# EAGLE design esp32-mementoV3-2021 (EAGLE 9.6.2)
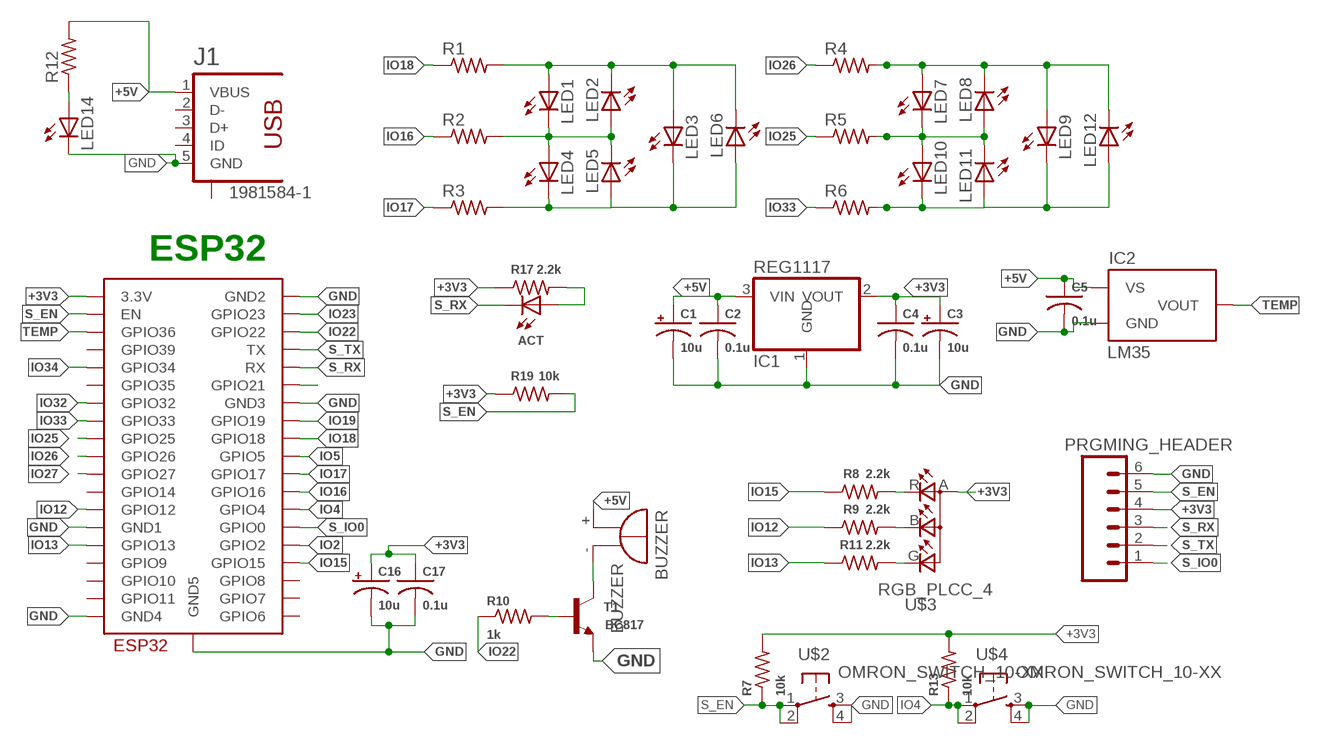
[diagram p0: schematic, sheet 1]

## Parts
ACT  LEDCHIPLED_1206  [CHIPLED_1206]
BUZZER  BUZZER  [F/TMB]
C1  10u  CAP_POL_16V  [B/3528-21R]
C2  0.1u  CAP0603  [C0603]
C3  10u  CAP_POL_16V  [B/3528-21R]
C4  0.1u  CAP0603  [C0603]
C5  0.1u  CAP0603  [C0603]
C16  10u  CAP_POL_16V  [B/3528-21R]
C17  0.1u  CAP0603  [C0603]
ESP32_MODULE  ESP32-WROOM  [ESP32-WROOM]
IC1  REG1117  [SOT223]
IC2  LM35  [TO92]
J1  1981584-1  [1981584-1]
LED1  LED1206  [CHIPLED_1206]
LED2  LED1206  [CHIPLED_1206]
LED3  LED1206  [CHIPLED_1206]
LED4  LED1206  [CHIPLED_1206]
LED5  LED1206  [CHIPLED_1206]
LED6  LED1206  [CHIPLED_1206]
LED7  LED1206  [CHIPLED_1206]
LED8  LED1206  [CHIPLED_1206]
LED9  LED1206  [CHIPLED_1206]
LED10  LED1206  [CHIPLED_1206]
LED11  LED1206  [CHIPLED_1206]
LED12  LED1206  [CHIPLED_1206]
LED14  LED1206  [CHIPLED_1206]
PRGMING_HEADER  M06  [06P]
R1  RESISTOR0805  [R0805]
R2  RESISTOR0805  [R0805]
R3  RESISTOR0805  [R0805]
R4  RESISTOR0805  [R0805]
R5  RESISTOR0805  [R0805]
R6  RESISTOR0805  [R0805]
R7  10k  R-US_M0805  [M0805]
R8  2.2k  R-US_R0805  [R0805]
R9  2.2k  R-US_R0805  [R0805]
R10  1k  R-US_M0805  [M0805]
R11  2.2k  R-US_R0805  [R0805]
R12  RESISTOR0805  [R0805]
R13  10k  R-US_M0805  [M0805]
R17  2.2k  R-US_R0805  [R0805]
R19  10k  R-US_R0805  [R0805]
T1  BC817  BC817-40SMD  [SOT23-BEC]
U$2  OMRON_SWITCH_10-XX  [B3F-10XX]
U$3  RGB_PLCC_4  [PLCC-4]
U$4  OMRON_SWITCH_10-XX  [B3F-10XX]

## Nets
+3V3 [POWER]: C3.+ C4.1 C16.+ C17.1 ESP32_MODULE.3V3(3.3V) IC1.2(VOUT) PRGMING_HEADER.4 R7.2 R13.2 R17.1 R19.1 U$3.A(A2)
+5V: BUZZER.+ C1.+ C2.1 C5.1 IC1.3(VIN) IC2.VS J1.1(VBUS) R12.2
GND [POWER]: C1.- C2.2 C3.- C4.2 C5.2 C16.- C17.2 ESP32_MODULE.GND1 ESP32_MODULE.GND2 ESP32_MODULE.GND3 ESP32_MODULE.GND4 ESP32_MODULE.GND5 IC1.1(GND) IC2.GND J1.5(GND) LED14.C PRGMING_HEADER.6 T1.E U$2.3(S) U$2.4(S1) U$4.3(S) U$4.4(S1)
IO2: ESP32_MODULE.IO2(GPIO2)
IO4: ESP32_MODULE.IO4(GPIO4) R13.1 U$4.1(P) U$4.2(P1)
IO5: ESP32_MODULE.IO5(GPIO5)
IO12: ESP32_MODULE.IO12(GPIO12) R9.1
IO13: ESP32_MODULE.IO13(GPIO13) R11.1
IO15: ESP32_MODULE.IO15(GPIO15) R8.1
IO16: ESP32_MODULE.IO16(GPIO16) R2.1
IO17: ESP32_MODULE.IO17(GPIO17) R3.1
IO18: ESP32_MODULE.IO18(GPIO18) R1.1
IO19: ESP32_MODULE.IO19(GPIO19)
IO22: ESP32_MODULE.IO22(GPIO22) R10.1
IO23: ESP32_MODULE.IO23(GPIO23)
IO25: ESP32_MODULE.IO25(GPIO25) R5.1
IO26: ESP32_MODULE.IO26(GPIO26) R4.1
IO27: ESP32_MODULE.IO27(GPIO27)
IO32: ESP32_MODULE.IO32(GPIO32)
IO33: ESP32_MODULE.IO33(GPIO33) R6.1
IO34: ESP32_MODULE.IO34(GPIO34)
N$1: LED1.A LED2.C LED3.A LED6.C R1.2
N$2: LED1.C LED2.A LED4.A LED5.C R2.2
N$3: LED3.C LED4.C LED5.A LED6.A R3.2
N$4: LED7.A LED8.C LED9.A LED12.C R4.2
N$5: LED7.C LED8.A LED10.A LED11.C R5.2
N$6: LED9.C LED10.C LED11.A LED12.A R6.2
N$12: BUZZER.- T1.C
N$13: ESP32_MODULE.IO21(GPIO21)
N$14: R10.2 T1.B
N$15: ACT.A R17.2
N$16: R8.2 U$3.R(CRED)
N$17: R9.2 U$3.B(CBLUE)
N$18: R11.2 U$3.G(CGREEN)
N$19: LED14.A R12.1
S_EN: ESP32_MODULE.EN PRGMING_HEADER.5 R7.1 R19.2 U$2.1(P) U$2.2(P1)
S_IO0: ESP32_MODULE.IO0(GPIO0) PRGMING_HEADER.1
S_RX: ACT.C ESP32_MODULE.RX PRGMING_HEADER.3
S_TX: ESP32_MODULE.TX PRGMING_HEADER.2
TEMP: ESP32_MODULE.SENSOR_VP(GPIO36) IC2.VOUT
Unconnected: ESP32_MODULE.CLK(GPIO6) ESP32_MODULE.CMD(GPIO11) ESP32_MODULE.IO14(GPIO14) ESP32_MODULE.IO35(GPIO35) ESP32_MODULE.SD0(GPIO7) ESP32_MODULE.SD1(GPIO8) ESP32_MODULE.SD2(GPIO9) ESP32_MODULE.SD3(GPIO10) ESP32_MODULE.SENSOR_VN(GPIO39) J1.2(D-) J1.3(D+) J1.4(ID) J1.S1

## Notes on the sheet
- ESP32

## Library data of the parts
ACT = adafruit:LED: LED OSRAM: - CHIPLED LG R971, LG N971, LY N971, LG Q971, LY Q971, LO R971, LY R971 LH N974, LH R974 LS Q976, LO Q976, LY Q976 LO Q996 - Hyper CHIPLED LW Q18S LB Q993, LB Q99A, LB R99A - SideLED LS A670, LO A670, LY A670, LG A670, LP A670 LB A673, LV A673, LT A673, LW A673 LH A674 LY A675 LS A676, LA A676, LO A676, LY A676, LW A676 LS A679, LY A679, LG A679 - Hyper Micro SIDELED® LS Y876, LA Y876, LO Y876, LY Y876 LT Y87S - SmartLED LW L88C, LW L88S LB L89C, LB L89S, LG L890 LS L89K, LO L89K, LY L89K LS L896, LA L896, LO L896, LY L896 - TOPLED LS T670, LO T670, LY T670, LG T670, LP T670 LSG T670, LSP T670, LSY T670, LOP T670, LYG T670 LG T671, LOG T671, LSG T671 LB T673, LV T673, LT T673, LW T673 LH T674 LS T676, LA T676, LO T676, LY T676, LB T676, LH T676, LSB T676, LW T676 LB T67C, LV T67C, LT T67C, LS T67K, LO T67K, LY T67K, LW E67C LS E67B, LA E67B, LO E67B, LY E67B, LB E67C, LV E67C, LT E67C LW T67C LS T679, LY T679, LG T679 LS T770, LO T770, LY T770, LG T770, LP T770 LB T773, LV T773, LT T773, LW T773 LH T774 LS E675, LA E675, LY E675, LS T675 LS T776, LA T776, LO T776, LY T776, LB T776 LHGB T686 LT T68C, LB T68C - Hyper Mini TOPLED® LB M676 - Mini TOPLED Santana® LG M470 LS M47K, LO M47K, LY M47K Source: http://www.osram.convergy.de/
BUZZER = CEDT_JANUARY_2015_v5:BUZZER: BUZZER Source: Buerklin; OC_FARNELL: unknown; OC_NEWARK: unknown
C1 C3 C16 = CEDT_JANUARY_2015_v5:CAP_POL
C2 C4 C5 C17 = CEDT_JANUARY_2015_v5:CAP
ESP32_MODULE = ESP32:ESP32-WROOM
IC1 = CEDT_JANUARY_2015_v5:REG1117: 800mA and 1A Low Dropout (LDO) Positive Regulator 1.8V, 2.5V, 2.85V, 3.3V, 5V, and Adj
IC2 = CEDT_JANUARY_2015_v5:LM35
J1 = audio amplifier example:1981584-1: Receptacle, micro-USB, type A/B Tyco Electronics
LED1-LED12 LED14 = CEDT_JANUARY_2015_v5:LED
PRGMING_HEADER = con-amp-quick:M06: AMP QUICK CONNECTOR; OC_FARNELL: unknown; OC_NEWARK: unknown
R1-R6 R12 = CEDT_JANUARY_2015_v5:RESISTOR
R7 R10 R13 = rcl:R-US_: RESISTOR, American symbol; SPICEPREFIX: R
R8 R9 R11 R17 R19 = rcl:R-US_: RESISTOR, American symbol
T1 = transistor-npn:BC817*: NPN Transistor
U$2 U$4 = CEDT_JANUARY_2015_v5:OMRON_SWITCH
U$3 = CEDT_JANUARY_2015_v5:RGB_PLCC_4

## Net classes
0 default: width 0.406 mm, drill 0.7 mm, clearance 0.25 mm
1 POWER: width 0.61 mm, drill 0.7 mm, clearance 0.25 mm

## Board
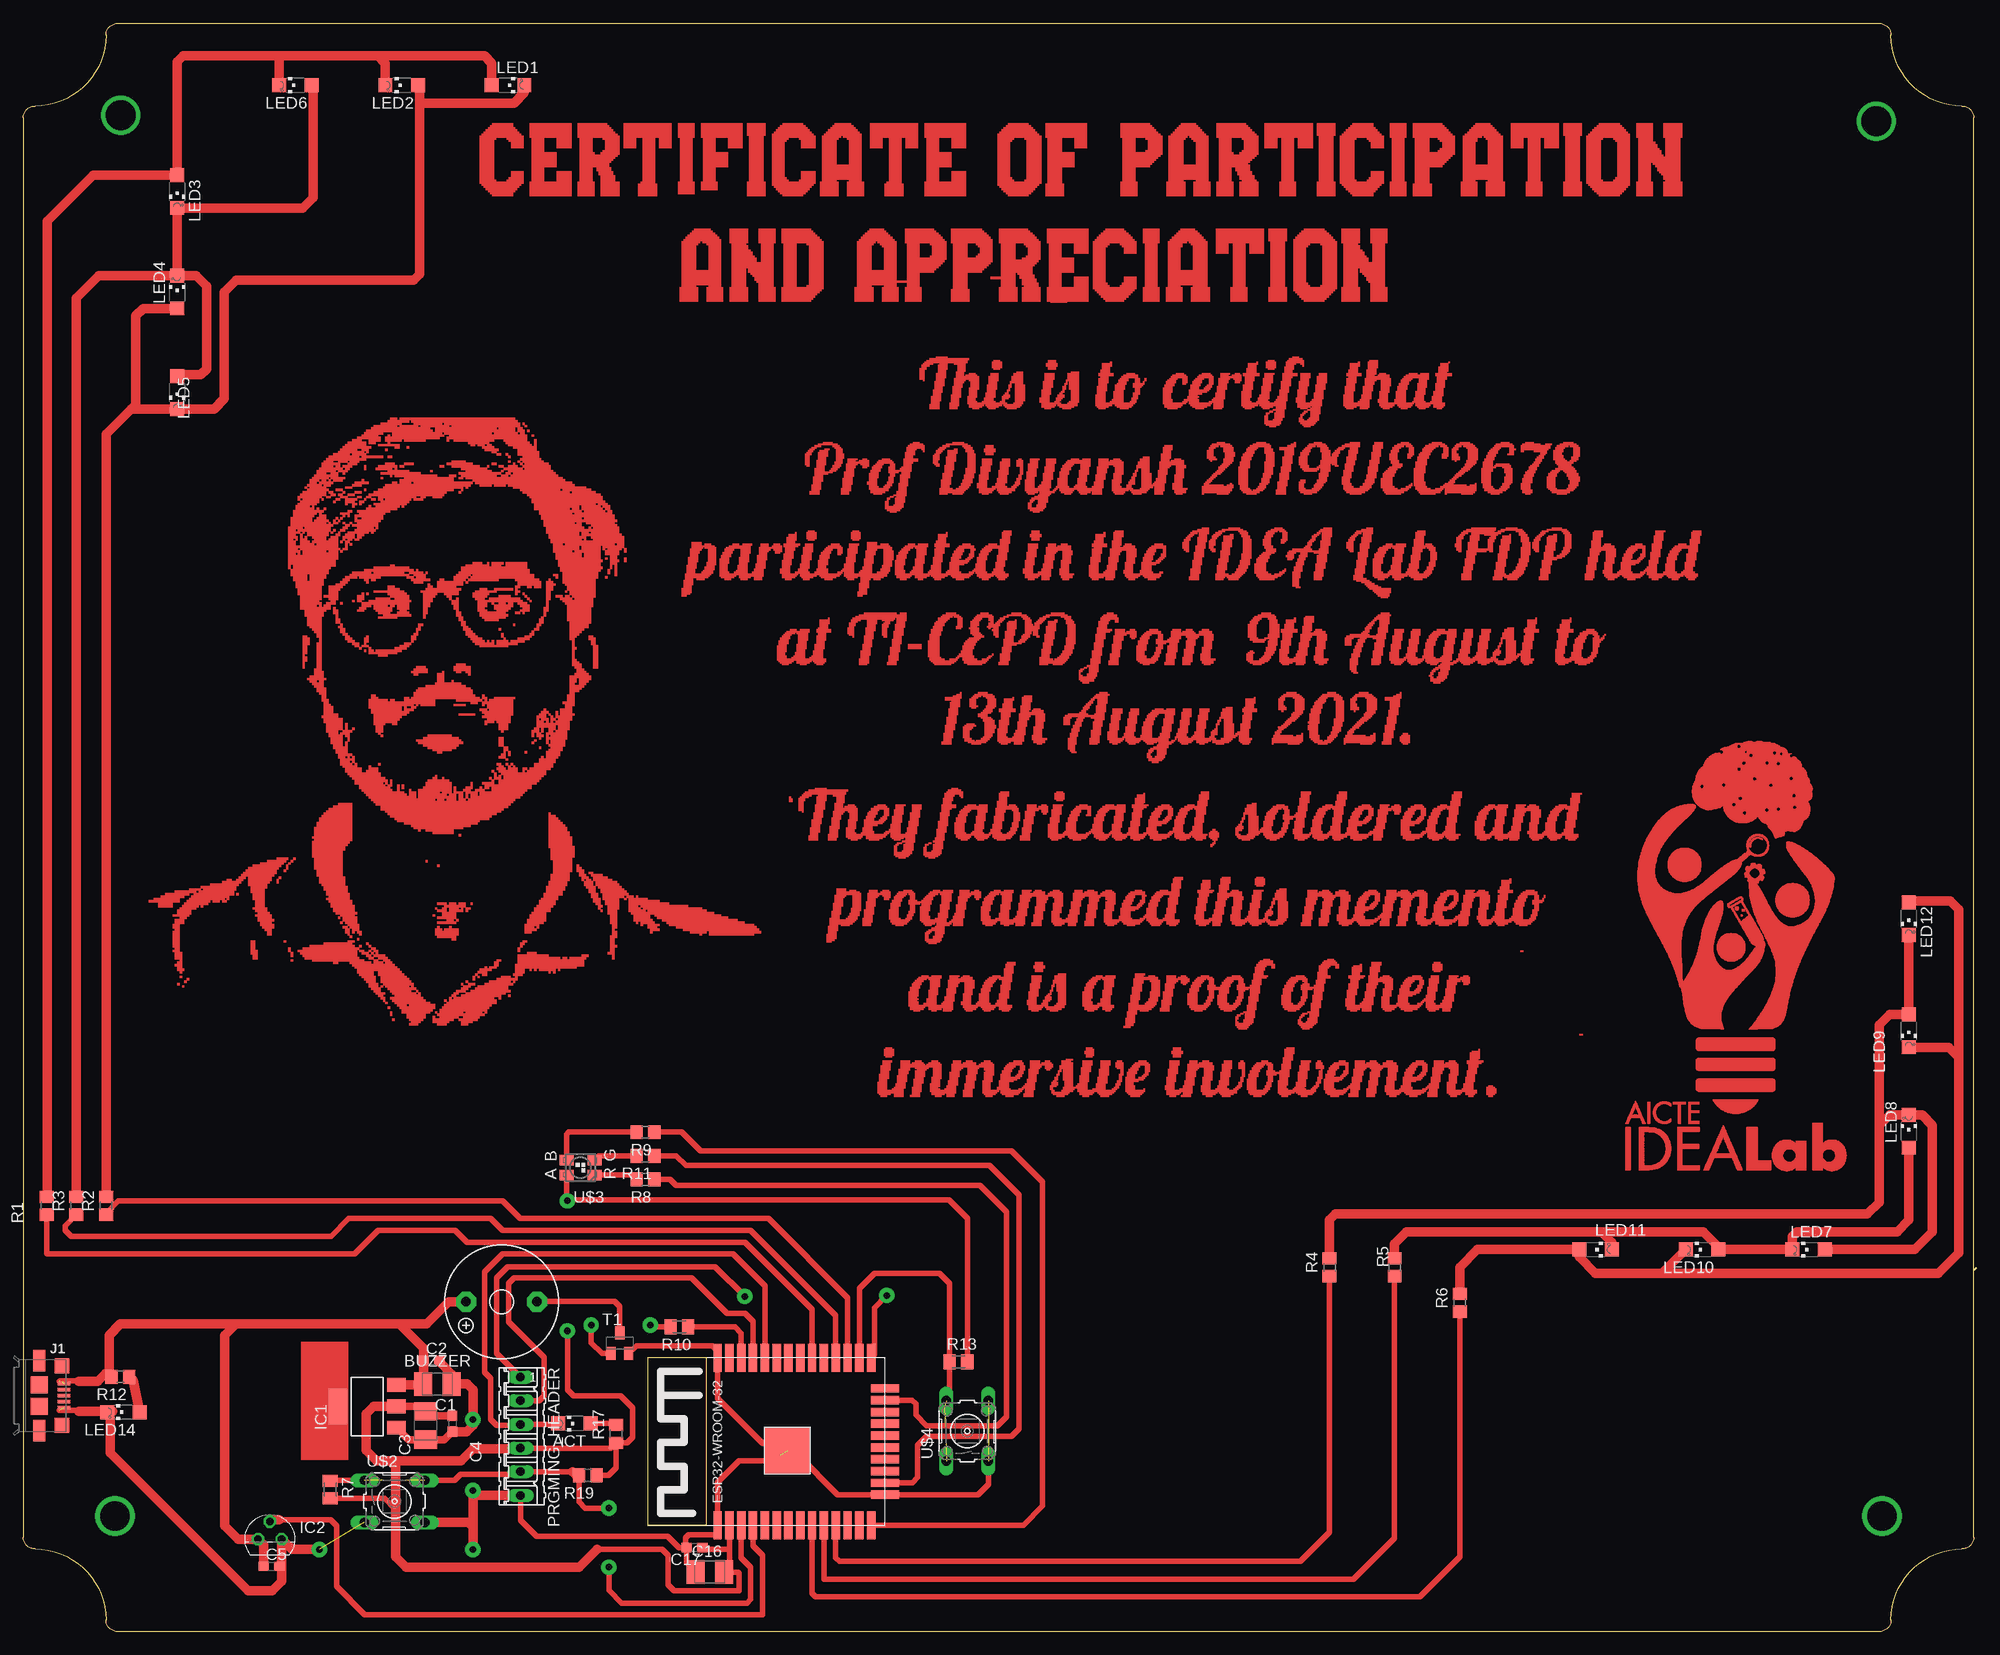
[diagram p1: board, top side]
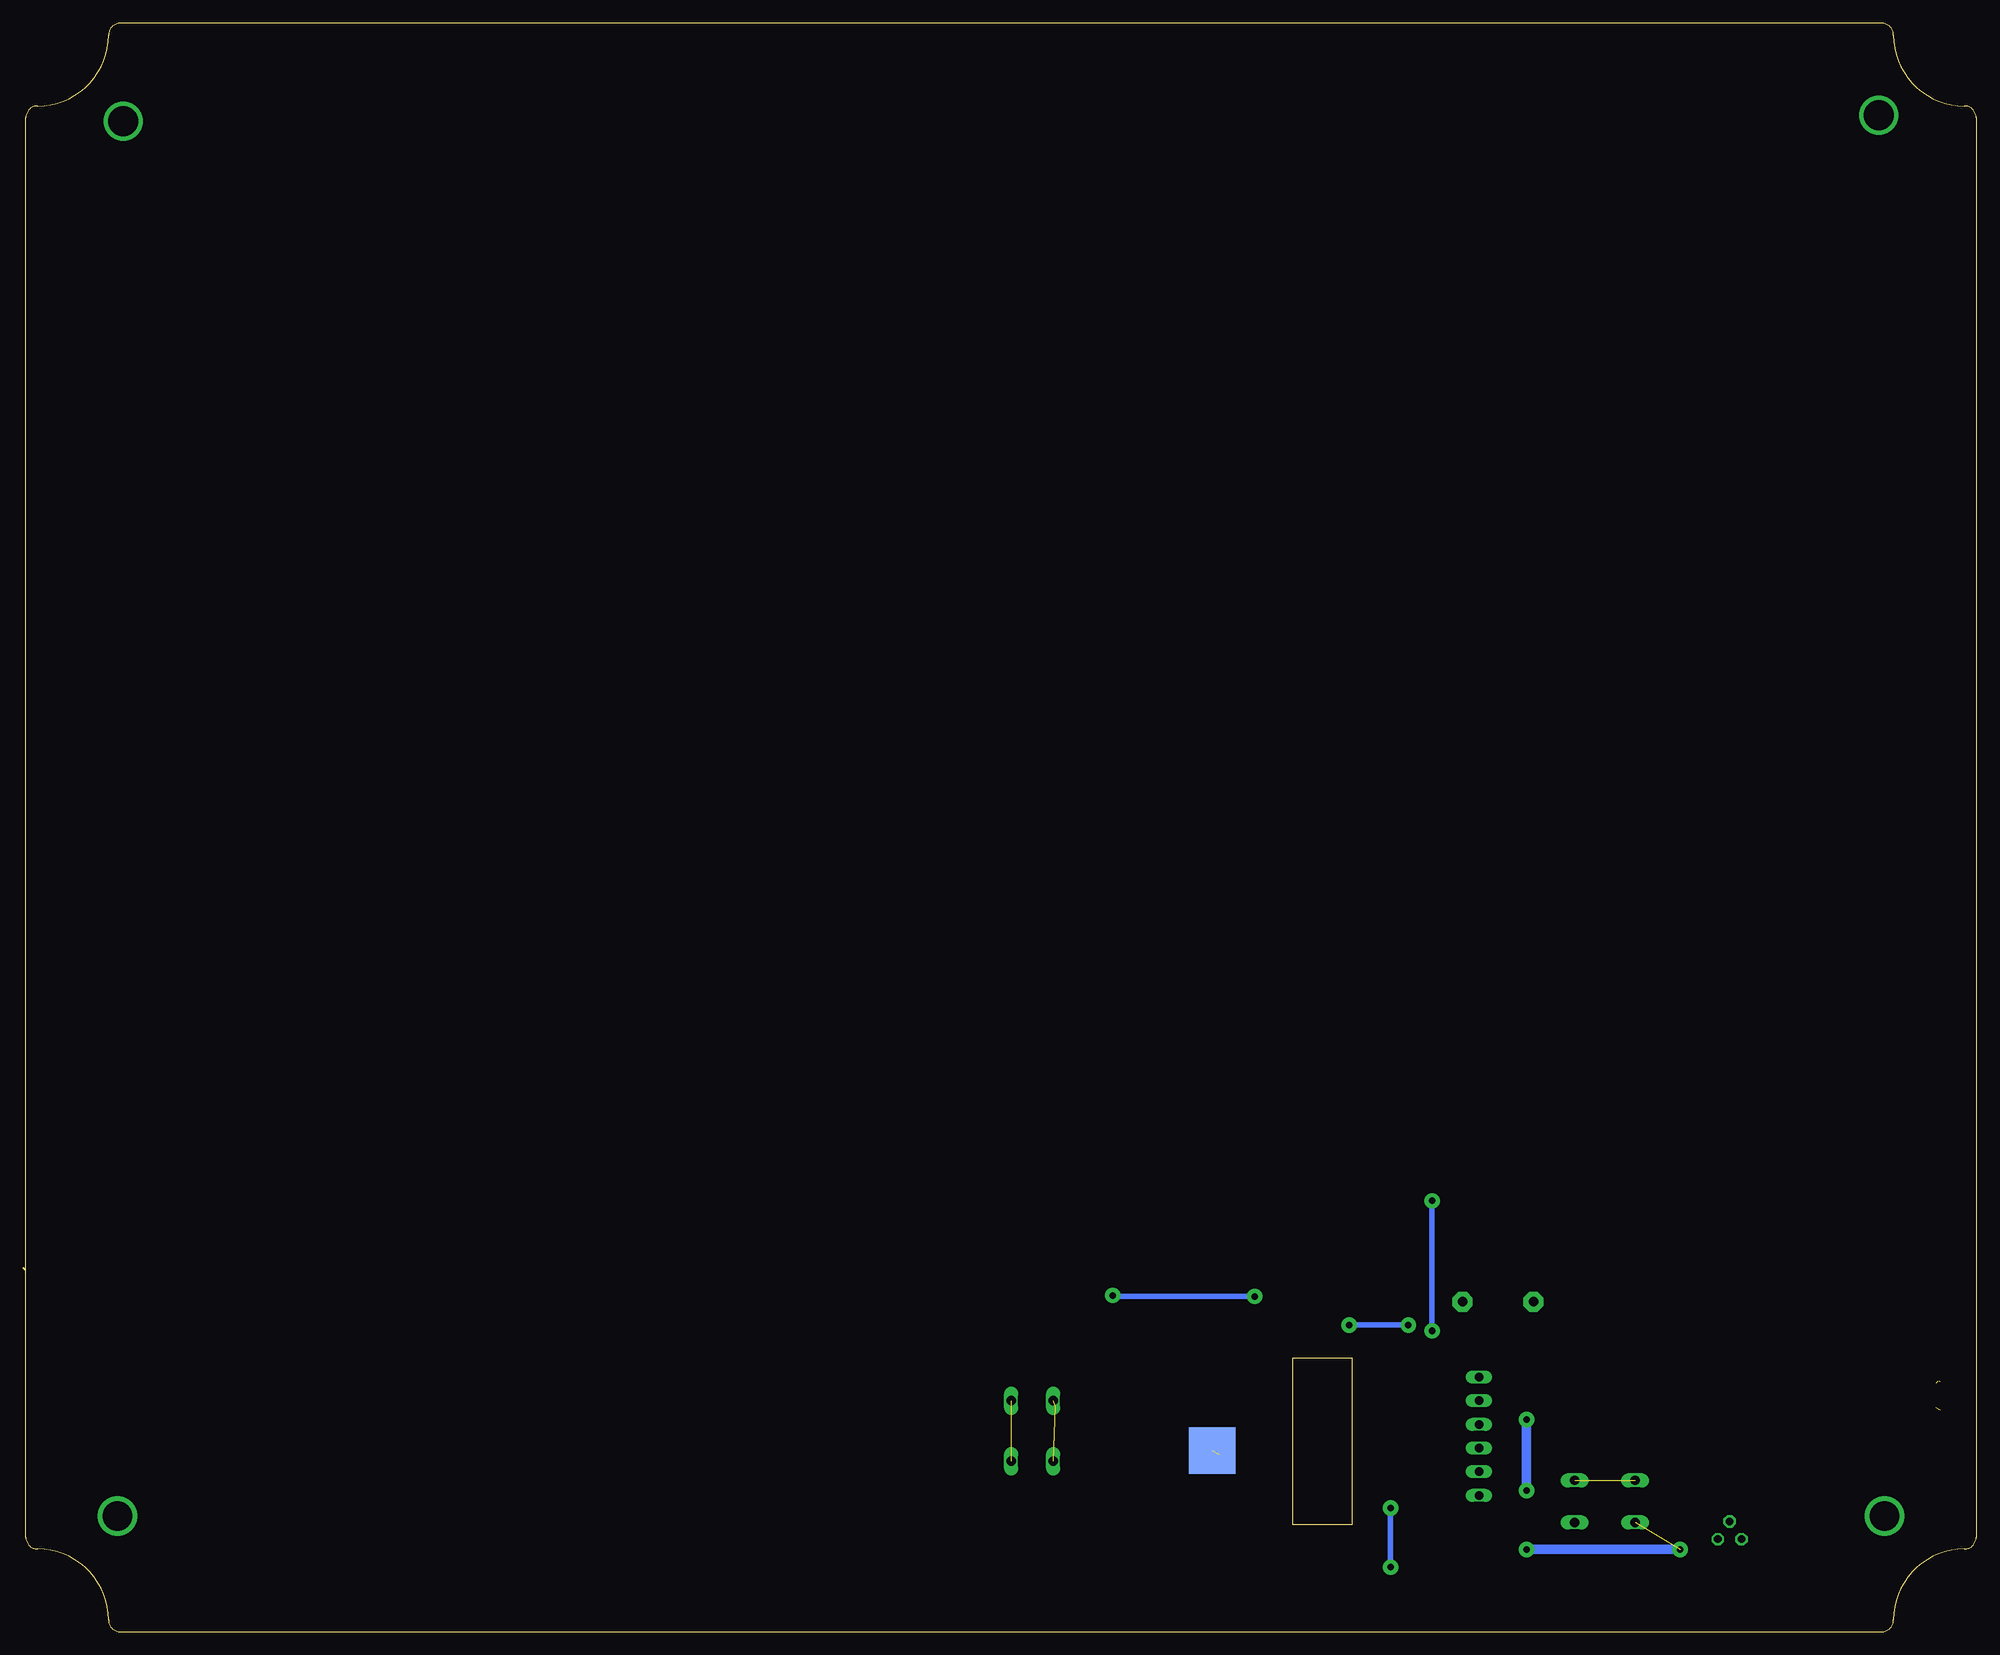
[diagram p2: board, bottom side, seen from below]

Size 209.82 x 172.81 mm. Coordinates in mm from the lower left corner, seen from the top.
Outline: 10.16,0 199.39,0 arc90 200.66,1.27
Outline: 200.66,1.27 arc-90 208.28,8.89 arc90 209.55,10.16 209.55,162.66 arc90 208.28,163.93 arc-90 200.66,171.55 arc90 199.39,172.82 10.16,172.82 arc90 8.89,171.55 arc-90 1.27,163.93 arc90 0,162.66 0,10.16 arc90 1.27,8.89 arc-90 8.89,1.27
Outline: 10.16,0 arc-90 8.89,1.27
Outline: 10.16,0 arc-90 8.89,1.27
Outline: 209.63,38.9 209.82,39.09
Outline: 73.4,29.45 67.07,29.45 67.07,11.47 73.4,11.47 73.4,29.45
Copper layers (1*16): Top 0.035mm / dielectric 1.5mm / Bottom 0.035mm
Design rules "default *": minimum track width 6mil, minimum drill 0.35mm, track to track 16mil, track to pad 16mil, pad to pad 16mil, via to via 16mil, smd to smd 16mil, copper to edge 40mil, drill to drill 6mil, minimum pad ring 10mil, minimum via ring 8mil, stop-mask expansion 4mil, vias tented up to drill 0mil, thermal gap 10mil

### Footprints (pad centres in the part's own frame; a part is rotated, then mirrored left to right if it is on the bottom)
CHIPLED_1206 = smd 1.5 x 1.5: A 0,-1.75; C 0,1.75
F/TMB = drill 1.016 pad 2.159 octagon: + 3.81,0; - -3.81,0
B/3528-21R = smd 1.95 x 2.5: + 1.525,0; - -1.525,0
C0603 = smd 1.1 x 1: 1 -0.85,0; 2 0.85,0
ESP32-WROOM = smd 3 x 0.9: 3V3 0,16.74; EN 0,15.47; GND1 0,18.01; GND3 18,18.01; IO0 18,1.5; IO4 18,2.77; IO5 18,6.58; IO12 0,1.5; IO14 0,2.77; IO16 18,4.04; IO17 18,5.31; IO18 18,7.85; IO19 18,9.12; IO21 18,11.66; IO22 18,15.47; IO23 18,16.74; IO25 0,6.58; IO26 0,5.31; IO27 0,4.04; IO32 0,9.12; IO33 0,7.85; IO34 0,11.66; IO35 0,10.39; NC 18,10.39; RX 18,12.93; SENSOR_VN 0,12.93; SENSOR_VP 0,14.2; TX 18,14.2 | smd 0.9 x 3: CLK 9.635,0; CMD 8.365,0; GND2 3.285,0; IO2 14.715,0; IO13 4.555,0; IO15 13.445,0; SD0 10.905,0; SD1 12.175,0; SD2 5.825,0; SD3 7.095,0 | smd 5 x 5: GND4 8,10.5 | smd 5 x 5 bottom: GND5 8,10.5
SOT223 = smd 1.499 x 2.007: 1 -2.261,-3.15; 2 0.025,-3.15; 3 2.311,-3.15 | smd 3.81 x 2.007: 4 0,3.15
TO92 = drill 0.813 octagon: GND 1.27,0; VOUT 0,1.905; VS -1.27,0
1981584-1 = smd 0.4 x 1.35: 1 -1.3,4.1; 2 -0.65,4.1; 3 0,4.1; 4 0.65,4.1; 5 1.3,4.1 | smd 1.8 x 1.8: M1 -1.15,1.45; M2 1.15,1.45 | smd 2.3 x 1.3: S1 -3.75,1.45; S2 3.75,1.45 | smd 1.6 x 1.6: S3 -3.2,3.885; S4 3.2,3.885
06P = drill 0.914 long: 1 -6.35,0; 2 -3.81,0; 3 -1.27,0; 4 1.27,0; 5 3.81,0; 6 6.35,0
R0805 = smd 1.3 x 1.5: 1 -0.95,0; 2 0.95,0
M0805 = smd 1.3 x 1.6: 1 -0.95,0; 2 0.95,0
SOT23-BEC = smd 1 x 1.4: B -0.95,-1.1; C 0,1.1; E 0.95,-1.1
B3F-10XX = drill 1.016 long: 1 -3.251,2.261; 2 3.251,2.261; 3 -3.251,-2.261; 4 3.251,-2.261
PLCC-4 = smd 1.1 x 1.5: A -0.8,1.5; B 0.8,1.5; G 0.8,-1.5; R -0.8,-1.5

### Placement (x,y rotation side)
ACT  59.2,22.37 90 top
BUZZER  51.38,35.45 180 top
C1  44.5,26.61 180 top
C2  43.87,29.15 0 top
C3  43.23,22.17 90 top
C4  46.09,22.34 270 top
C5  26.67,7.03 0 top
C16  73.76,6.41 0 top
C17  72.1,9.03 180 top
ESP32_MODULE  92.6,11.44 90 top
IC1  36.94,24.2 90 top
IC2  26.49,9.94 0 top
J1  0.27,25.37 270 top
LED1  52.09,166.15 270 top
LED2  40.66,166.15 90 top
LED3  16.53,154.72 180 top
LED4  16.53,143.93 0 top
LED5  16.53,133.13 180 top
LED6  29.23,166.15 90 top
LED7  191.79,41.06 90 top
LED8  202.58,53.76 0 top
LED9  202.58,64.55 180 top
LED10  180.36,41.06 90 top
LED11  168.93,41.06 270 top
LED12  202.58,76.62 180 top
LED14  10.75,23.59 90 top
PRGMING_HEADER  53.43,21 270 top
R1  2.54,45.77 90 top
R2  8.89,45.77 90 top
R3  5.71,45.77 90 top
R4  140.35,39.15 90 top
R5  147.34,39.15 90 top
R6  154.32,35.34 90 top
R7  32.97,15.28 270 top
R8  66.85,48.59 180 top
R9  66.85,53.67 180 top
R10  70.48,32.75 180 top
R11  66.85,51.13 180 top
R12  10.43,27.4 180 top
R13  100.47,28.99 0 top
R17  63.7,21.26 90 top
R19  60.65,16.8 180 top
T1  64.08,31 0 top
U$2  39.89,14.01 0 top
U$3  59.86,49.86 90 top
U$4  101.43,21.56 90 top

### Tracks (layer width: path | path; a pad name or v marks a point on that pad's centre or on a via)
+3V3  (via drill 0.7 pad 1.65)
  Top 0.61: 37.67,24.22 40.69,24.22 | 61.65,8.83 68.63,8.83 69.27,8.2 69.27,5.02 69.9,4.39 76.89,4.39 76.89,6.29 76.77,6.41 C16.+ 75.86,6.98 75.86,8.83 | R17.1 63.7,17.63 62.87,16.8 R19.1 | C17.1 73.15,8.83 75.86,8.83 | U$3.A 58.36,46.4 | v58.47,32.33 58.47,25.98 59.11,25.34 64.19,25.34 65.46,24.07 65.46,20.9 64.87,20.31 R17.1 | ESP32_MODULE.3V3 75.86,8.83 | R13.2 101.42,44.43 99.44,46.4 58.36,46.4 | v58.47,46.3 58.36,46.4 | R7.2 38.81,14.33 40.02,13.12 | R17.1 63.12,19.73 PRGMING_HEADER.4
  Top 0.813: IC1.2 40.69,24.22 42.7,24.22 C3.+ 43.73,23.19 C4.1
  Top 1.016: PRGMING_HEADER.4 53.32,19.63 48.31,19.63 47.04,18.36 39.39,18.36 | IC1.2 37.67,24.22 36.85,23.4 36.85,19.47 37.96,18.36 39.39,18.36 | 61.65,8.83 59.74,6.93 41.13,6.93 40.02,8.04 40.02,13.12 40.02,17.72 39.39,18.36
  Bottom 0.61: v58.47,46.3 v58.47,32.33
+5V  (2 unrouted)
  Top 0.61: 5.98,26.9 5.95,26.9 5.91,26.93 3.99,26.93 | 4.15,26.9 3.89,26.9
  Top 1.016: IC1.3 42.12,26.51 42.54,26.08 42.54,26.18 C1.+ 43.02,26.65 C2.1 43.02,30.42 40.37,33.07 | 40.37,33.07 22.86,33.07 | C5.1 25.82,9.34 IC2.VS 23.07,9.94 21.64,11.37 21.64,31.85 22.86,33.07 | 40.37,33.07 43.34,33.07 45.72,35.45 BUZZER.+ | 5.98,26.9 7.98,26.9 8.85,27.77 9.22,27.4 | R12.2 9.22,27.4 | 9.22,27.4 9.22,31.85 10.44,33.07 22.86,33.07
GND  (via drill 0.7 pad 1.65)  (5 unrouted)
  Top 0.61: PRGMING_HEADER.6 53.43,11.97 55.14,10.26 69.23,10.26 70.46,9.03 C17.2 | T1.E 65.87,30.74 74.03,30.74 74.59,30.18 ESP32_MODULE.GND3 74.59,25.1 79.43,20.26 82.6,20.26 82.6,19.94 ESP32_MODULE.GND5 82.6,18.94 82.6,18.36 76.89,18.36 74.59,16.06 ESP32_MODULE.GND1 74.59,10.42 | 74.59,10.42 74.59,10.34 | C17.2 71.25,7.39 C16.- | C17.2 71.17,9.11 71.17,10.1 71.49,10.42 74.59,10.42 | 81.33,18.99 83.24,18.99 87.5,14.73 ESP32_MODULE.GND2 102.59,14.73 103.69,15.82 U$4.3 | 5.98,23.66 5.98,23.81 3.89,23.81
  Top 0.813: IC1.1 41.38,20.64 C3.- 45.24,20.64 C4.2
  Top 1.016: C2.2 44.72,28.99 46.03,27.68 C1.- 47.68,26.61 48.31,25.98 v48.31,22.8 48.31,22.17 47.64,21.49 C4.2 | IC1.1 40.34,21.94 | 27.76,7.28 IC2.GND 28.87,8.83 v31.8,8.83 | 27.76,7.28 C5.2 | 27.76,7.28 27.76,5.43 26.72,4.39 24.18,4.39 9.35,19.22 9.35,22.96 8.65,23.66 | PRGMING_HEADER.6 48.84,14.65 v48.31,15.18 48.31,11.21 | v48.31,8.83 48.31,11.21 | 5.98,23.66 8.65,23.66 | 8.65,23.66 9.63,23.66 LED14.C | U$2.4 47.78,11.75 48.31,11.21
  Bottom 1.016: v48.31,22.8 v48.31,15.18 | v48.31,8.83 v31.8,8.83
IO4  (2 unrouted)
  Top 0.61: 98.95,24.23 99.52,24.8 R13.1 99.52,37.44 98.44,38.52 91.46,38.52 89.83,36.89 ESP32_MODULE.IO4
IO12
  Top 0.61: ESP32_MODULE.IO12 107.44,11.44 109.53,13.53 109.53,48.33 106.2,51.66 72.76,51.66 70.75,53.67 R9.1
IO13
  Top 0.61: ESP32_MODULE.IO13 95.52,16 96.09,16.57 96.09,20.04 97.04,20.99 106.19,20.99 106.99,21.79 106.99,46.94 103.83,50.09 71.19,50.09 70.14,51.13 R11.1
IO15
  Top 0.61: ESP32_MODULE.IO15 95.48,24.89 95.9,24.47 95.9,23.28 97.04,22.13 104.66,22.13 105.62,23.09 105.62,45.12 102.77,47.96 70.14,47.96 69.51,48.59 R8.1
IO16
  Top 0.61: ESP32_MODULE.IO16 88.56,35.89 80.06,44.39 53.39,44.39 51.49,46.3 10.21,46.3 8.89,44.97 R2.1
IO17
  Top 0.61: ESP32_MODULE.IO17 87.29,33.99 78.16,43.12 51.49,43.12 50.22,44.39 34.98,44.39 33.07,42.49 5.13,42.49 4.5,43.12 4.5,43.6 R3.1
IO18
  Top 0.61: ESP32_MODULE.IO18 84.75,34.62 77.52,41.85 47.68,41.85 46.41,43.12 38.15,43.12 35.61,40.58 2.59,40.58 2.54,40.63 R1.1
IO22
  Top 0.61: R10.1 76.46,32.75 77.13,32.08 ESP32_MODULE.IO22
IO25
  Top 0.61: ESP32_MODULE.IO25 86.02,5.66 142.93,5.66 147.34,10.06 R5.1
IO26
  Top 0.61: R4.1 140.35,10.7 137.21,7.56 87.68,7.56 87.29,7.95 ESP32_MODULE.IO26
IO33
  Top 0.61: ESP32_MODULE.IO33 84.75,4.14 85.14,3.75 150.03,3.75 154.32,8.04 R6.1
N$1
  Top 1.016: R1.2 2.59,46.77 2.59,151.55 7.52,156.47 LED3.A 16.53,168.69 17.16,169.33 27.48,169.33 | LED6.C 27.48,169.33 | 38.12,169.33 38.91,168.54 LED2.C | 27.48,169.33 38.12,169.33 | 38.12,169.33 49.55,169.33 50.34,168.54 LED1.A
N$2
  Top 1.016: 8.72,46.88 R2.2 8.89,128.67 11.6,131.38 | 16.37,142.02 LED4.A 12.87,142.18 12.08,141.39 12.08,131.86 11.6,131.38 | 11.6,131.38 LED5.C 20.49,131.38 21.61,132.5 21.61,143.93 22.88,145.2 41.93,145.2 42.56,145.83 42.56,164.25 | 42.56,164.25 42.56,166 LED2.A | 42.56,164.25 52.72,164.25 53.84,165.36 LED1.C
N$3
  Top 1.016: LED4.C LED3.C 30.02,152.97 31.13,154.09 31.13,166 LED6.A | LED4.C 16.68,145.83 | R3.2 5.71,143.28 8.12,145.68 LED4.C | LED5.A 16.68,135.04 19.07,135.04 19.7,135.67 19.7,144.56 18.59,145.68 LED4.C
N$4
  Top 1.016: R4.2 140.35,44.23 140.99,44.87 198.14,44.87 199.41,46.14 199.41,54.39 | 199.41,54.39 200.52,55.51 LED8.C 204.01,55.51 205.12,54.39 205.12,42.96 203.22,41.06 LED7.A | 199.41,54.39 199.41,65.19 200.52,66.3 LED9.A LED12.C
N$5
  Top 1.016: 189.88,41.21 LED7.C | R5.2 147.34,41.69 148.61,42.96 169.56,42.96 | 169.56,42.96 170.68,41.85 LED11.C | 169.56,42.96 180.51,42.96 182.26,41.21 LED10.A LED7.C | LED7.C 190.04,42.48 190.52,42.96 201.31,42.96 202.58,44.23 LED8.A
N$6
  Top 1.016: 202.74,62.65 LED9.C 206.87,62.8 207.96,61.71 | R6.2 154.32,39.15 156.23,41.06 LED11.A 167.18,40.27 168.93,38.52 176.07,38.52 | LED10.C 176.07,38.52 | 176.07,38.52 205.76,38.52 207.96,40.72 207.96,61.71 | 207.96,61.71 207.96,77.59 207.03,78.52 202.74,78.52 LED12.A
N$7  (via drill 3.2 pad 3.81)
  other vias: 199.07,162.29
N$8  (via drill 3.2 pad 3.81)
  other vias: 199.71,12.43
N$9  (via drill 3.2 pad 3.81)
  other vias: 10.48,162.92
N$10  (via drill 3.2 pad 3.81)
  other vias: 9.84,12.43
N$12
  Top 0.61: BUZZER.- 55.24,35.5 63.55,35.5 64.08,34.97 T1.C
N$14  (via drill 0.7 pad 1.65)
  Top 0.61: R10.2 67.57,32.75 v67.36,32.96 | v61.01,32.96 61.01,31.06 62.17,29.9 T1.B
  Bottom 0.61: v67.36,32.96 v61.01,32.96
N$15
  Top 0.61: ACT.A 63.54,22.37 R17.2
N$16
  Top 0.61: U$3.R 65.43,49.06 R8.2
N$17
  Top 0.61: U$3.B 58.36,53.44 58.59,53.67 R9.2
N$18
  Top 0.61: U$3.G 61.83,51.13 R11.2
N$19
  Top 1.016: R12.1 11.8,26.99 LED14.A
S_EN  (via drill 0.7 pad 1.65)  (1 unrouted)
  Top 0.61: 59,17.19 53.99,17.19 | 53.99,17.19 PRGMING_HEADER.5 | v62.92,6.93 62.92,4.44 64.29,3.06 77.75,3.06 78.16,3.48 78.16,6.93 77.13,7.95 ESP32_MODULE.EN | v62.92,13.28 60.38,13.28 59.7,13.95 R19.2 | U$2.2 46.32,16.27 46.98,16.93 53.73,16.93 53.99,17.19 | R7.1 33.01,16.27 U$2.1
  Top 1.016: 59,17.19 59.39,16.8 R19.2
  Bottom 0.61: v62.92,13.28 v62.92,6.93
S_IO0  (via drill 0.7 pad 1.65)
  Top 0.61: ESP32_MODULE.IO0 91.44,29.79 91.44,34.82 v92.76,36.14 | v77.52,36.03 74.35,39.2 52.01,39.2 50.85,38.04 50.85,29.92 PRGMING_HEADER.1
  Bottom 0.61: v92.76,36.14 92.65,36.03 v77.52,36.03
S_RX
  Top 0.61: ESP32_MODULE.RX 79.67,37.16 76.25,40.58 51.49,40.58 49.58,38.68 49.58,27.88 50.22,27.25 50.22,22.8 50.85,22.17 53.32,22.17 PRGMING_HEADER.3 57.35,22.27 ACT.C
S_TX
  Top 0.61: ESP32_MODULE.TX 78.4,33.35 77.52,34.23 75.62,34.23 71.81,38.04 52.76,38.04 52.12,37.41 52.12,33.28 55.93,29.47 55.93,25.34 55.4,24.81 PRGMING_HEADER.2
TEMP
  Top 0.61: 27.51,12.01 33.04,12.01 33.67,11.37 33.67,4.86 36.69,1.85 79.43,1.85 79.43,8.2 78.4,9.22 ESP32_MODULE.SENSOR_VP
  Top 1.016: 26.66,12.01 26.49,12.01 | IC2.VOUT 26.66,12.01 | 26.66,12.01 27.51,12.01
(copper drawn outside any net)
  shapes: Top area x16427